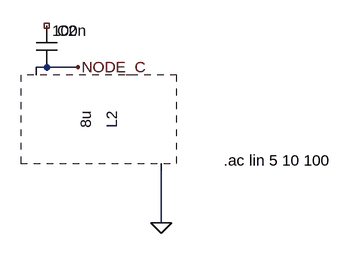
[diagram p0: schematic case_12.asc]
case_12.asc, the LTspice schematic file:
Version 4.1
SHEET 1 880 680
WIRE 192 256 256 256
WIRE 384 416 384 496
FLAG 256 256 NODE_C
FLAG 384 496 0
SYMBOL cap 192 256 M180
WINDOW 0 32 56 Left 2
SYMATTR InstName C2
SYMATTR Value 100n
SYMATTR SpiceLine Rpar=1Meg
SYMBOL Passive\ind 384 416 M270
SYMATTR InstName L2
SYMATTR Value 8u
SYMATTR Type ind
TEXT 480 400 Left 2 !.ac lin 5 10 100

The netlist it stands for:
* case_12.asc
C2 NODE_C NC_01 100n Rpar=1Meg
* L2: 8u (symbol Passive\ind not available, pin order unknown); nets seen at it: 0, NODE_C
.ac lin 5 10 100
.backanno
.end